# EAGLE design GiGaMega_sield_2 (EAGLE 8.0.0)
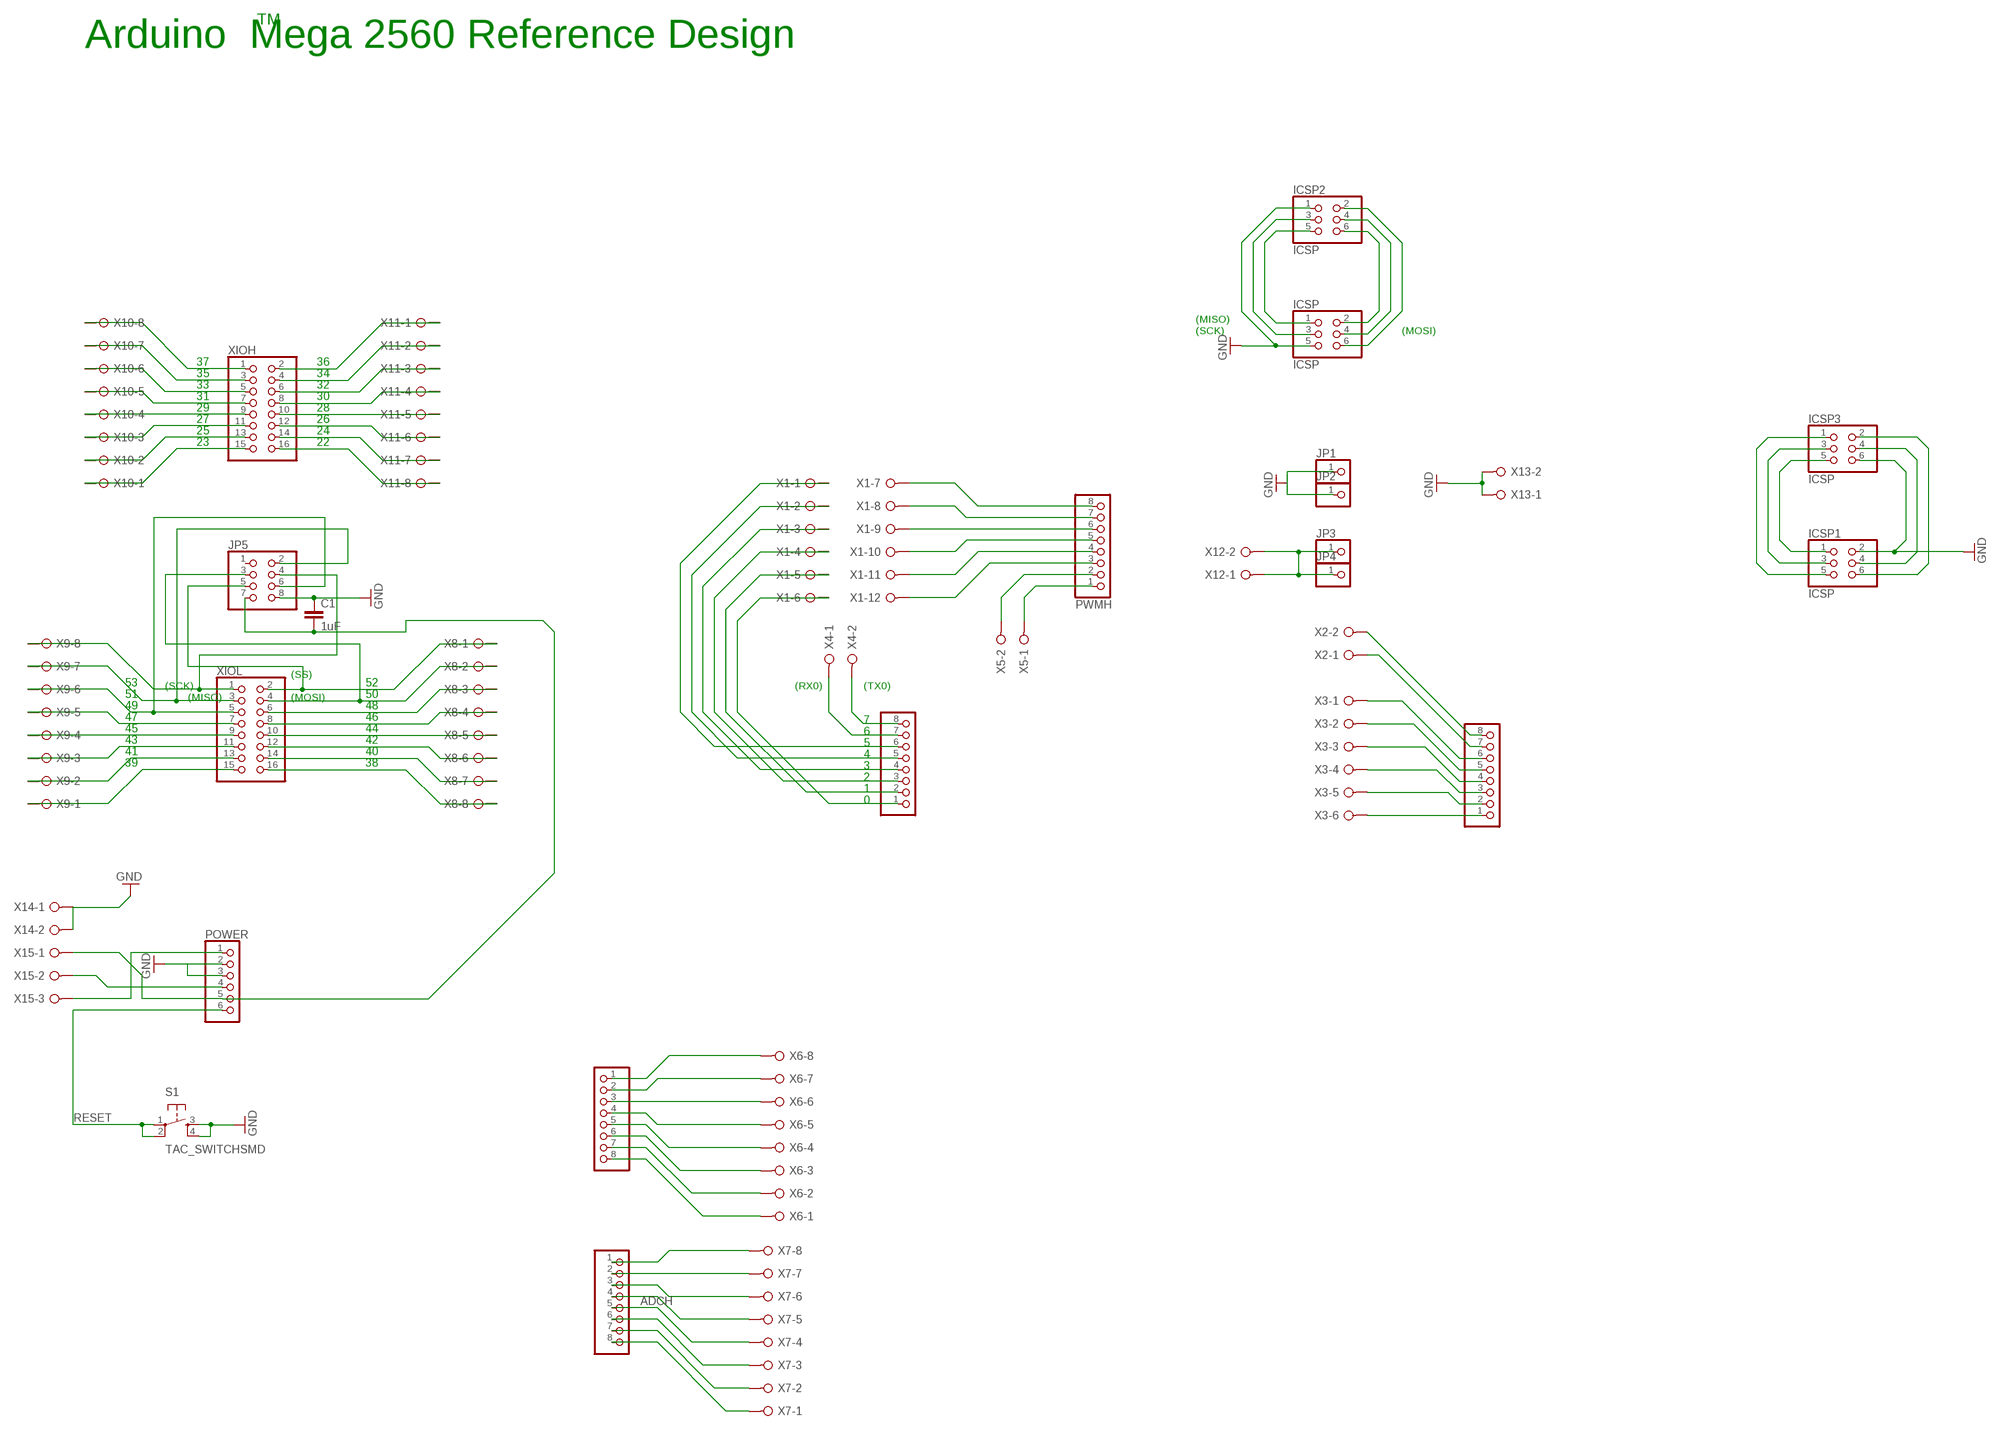
[diagram p0: schematic, sheet 1]

## Parts
ADCH  PINHD-1X8  [1X08]
ADCL  PINHD-1X8  [1X08]
C1  1uF  2.2UF-CERCAP-10009  [1206]
COMMUNICATION  PINHD-1X8  [1X08]
ICSP  ICSP  PINHD-2X3  [2X03]
ICSP1  ICSP  PINHD-2X3  [2X03]
ICSP2  ICSP  PINHD-2X3  [2X03]
ICSP3  ICSP  PINHD-2X3  [2X03]
JP1  PINHD-1X1  [1X01]
JP2  PINHD-1X1  [1X01]
JP3  PINHD-1X1  [1X01]
JP4  PINHD-1X1  [1X01]
JP5  PINHD-2X4  [2X04]
POWER  PINHD-1X6  [1X06]
PWMH  PINHD-1X8  [1X08]
PWML  PINHD-1X8  [1X08]
S1  TAC_SWITCHSMD  [TACTILE-SWITCH-SMD]
X1  W237-12P  [W237-12P]
X2  W237-02P  [W237-132]
X3  W237-06P  [W237-6P]
X4  W237-02P  [W237-132]
X5  W237-02P  [W237-132]
X6  W237-08P  [W237-8P]
X7  W237-08P  [W237-8P]
X8  W237-08P  [W237-8P]
X9  W237-08P  [W237-8P]
X10  W237-08P  [W237-8P]
X11  W237-08P  [W237-8P]
X12  W237-02P  [W237-132]
X13  W237-02P  [W237-132]
X14  W237-02P  [W237-132]
X15  W237-03P  [W237-133]
XIOH  PINHD-2X8  [2X08]
XIOL  PINHD-2X8  [2X08]

## Nets
CE: JP5.6 X9.6 XIOL.5
CSN: JP5.5 X8.1 XIOL.2
GND: C1.1 ICSP1.2 ICSP2.1 ICSP3.6 ICSP.5 JP1.1 JP2.1 JP5.8 POWER.2 POWER.3 S1.3 S1.4 X13.1 X13.2 X14.1 X14.2
MISO: JP5.2 X9.7 XIOL.3
MOSI: JP5.3 X8.2 XIOL.4
N: X8.3 XIOL.6
N$1: ICSP1.1 ICSP3.5
N$2: ICSP1.3 ICSP3.3
N$3: PWMH.8 X1.7
N$4: PWMH.7 X1.8
N$5: PWMH.6 X1.9
N$6: PWMH.5 X1.10
N$7: PWMH.4 X1.11
N$8: PWMH.3 X1.12
N$9: PWML.1 X1.6
N$10: PWML.2 X1.5
N$11: PWML.3 X1.4
N$12: PWML.4 X1.3
N$13: PWML.5 X1.2
N$14: PWML.6 X1.1
N$15: ICSP2.5 ICSP.1
N$16: ICSP2.3 ICSP.3
N$17: ICSP1.5 ICSP3.1
N$18: ICSP2.6 ICSP.2
N$19: ICSP2.4 ICSP.4
N$20: ICSP1.6 ICSP3.2
N$21: ICSP2.2 ICSP.6
N$23: ICSP1.4 ICSP3.4
N$25: COMMUNICATION.1 X3.6
N$26: COMMUNICATION.2 X3.5
N$27: COMMUNICATION.3 X3.4
N$28: COMMUNICATION.4 X3.3
N$29: COMMUNICATION.5 X3.2
N$30: COMMUNICATION.6 X3.1
N$31: COMMUNICATION.7 X2.1
N$32: COMMUNICATION.8 X2.2
N$33: PWML.8 X4.2
N$34: PWML.7 X4.1
N$35: PWMH.2 X5.2
N$36: PWMH.1 X5.1
N$37: ADCL.1 X6.8
N$38: ADCH.1 X7.8
N$39: ADCH.2 X7.7
N$40: ADCL.2 X6.7
N$41: ADCL.3 X6.6
N$42: ADCL.4 X6.5
N$43: ADCL.5 X6.4
N$44: ADCL.6 X6.3
N$45: ADCL.7 X6.2
N$46: ADCL.8 X6.1
N$47: ADCH.3 X7.6
N$48: ADCH.4 X7.5
N$49: ADCH.5 X7.4
N$50: ADCH.6 X7.3
N$51: ADCH.7 X7.2
N$52: ADCH.8 X7.1
N$53: X10.8 XIOH.1
N$54: X11.1 XIOH.2
N$57: X10.7 XIOH.3
N$58: X10.6 XIOH.5
N$59: X10.5 XIOH.7
N$60: X10.4 XIOH.9
N$61: X10.3 XIOH.11
N$62: X10.2 XIOH.13
N$63: X10.1 XIOH.15
N$64: X11.2 XIOH.4
N$65: X11.3 XIOH.6
N$66: X11.4 XIOH.8
N$67: X11.5 XIOH.10
N$68: X11.6 XIOH.12
N$69: X11.7 XIOH.14
N$70: X11.8 XIOH.16
N$73: X9.5 XIOL.7
N$74: X9.4 XIOL.9
N$75: X9.3 XIOL.11
N$76: X9.2 XIOL.13
N$77: X9.1 XIOL.15
N$80: X8.4 XIOL.8
N$81: X8.5 XIOL.10
N$82: X8.6 XIOL.12
N$83: X8.7 XIOL.14
N$84: X8.8 XIOL.16
N$85: POWER.1 X15.3
N$86: POWER.4 X15.2
N$90: C1.2 JP5.7 POWER.5 X15.1
N$92: JP3.1 JP4.1 X12.1 X12.2
RESET: POWER.6 S1.1 S1.2
SCK: JP5.4 X9.8 XIOL.1
Unconnected: JP5.1

## Notes on the sheet
- TM
- Arduino  Mega 2560 Reference Design
- (MISO)
- (SCK) | (MOSI)
- 37 | 36
- 35 | 34
- 33 | 32
- 31 | 30
- 29 | 28
- 27 | 26
- 25 | 24
- 23 | 22
- (SS)
- 53 | (SCK) | 52 | (RX0) | (TX0)
- 51 | (MISO) | (MOSI) | 50
- 49 | 48
- 47 | 46 | 7
- 45 | 44 | 6
- 43 | 42 | 5
- 41 | 40 | 4
- 39 | 38 | 3
- 2
- 1
- 0

## Library data of the parts
ADCH ADCL COMMUNICATION PWMH PWML = pinhead:PINHD-1X8: PIN HEADER
C1 = SparkFun-Retired:2.2UF-CER: 2.2uF Ceramic SMT CAP-07888- 10V, 20% (0603) CAP-10009- 50V, 10% (1206); PROD_ID: CAP-10009; VALUE: 2.2uF
ICSP ICSP1-ICSP3 = pinhead:PINHD-2X3: PIN HEADER
JP1-JP4 = pinhead:PINHD-1X1: PIN HEADER
JP5 = pinhead:PINHD-2X4: PIN HEADER
POWER = pinhead:PINHD-1X6: PIN HEADER
S1 = SparkFun-Retired:TAC_SWITCH: Momentary Switch Button commonly used for reset or general input. Spark Fun Electronics SKU : COM-00097 SMT- SWCH-08247; PROD_ID: SWCH-08247
X1 = con-wago-508:W237-12P: WAGO SREW CLAMP; OC_FARNELL: unknown; OC_NEWARK: unknown
X2 X4 X5 X12-X14 = con-wago-508:W237-02P: WAGO SREW CLAMP; OC_FARNELL: unknown; OC_NEWARK: unknown
X3 = con-wago-508:W237-06P: WAGO SREW CLAMP; OC_FARNELL: unknown; OC_NEWARK: unknown
X6-X11 = con-wago-508:W237-08P: WAGO SREW CLAMP; OC_FARNELL: unknown; OC_NEWARK: unknown
X15 = con-wago-508:W237-03P: WAGO SREW CLAMP; OC_FARNELL: unknown; OC_NEWARK: unknown
XIOH XIOL = pinhead:PINHD-2X8: PIN HEADER

## Net classes
0 default: width 0.15 mm, drill 0.3 mm, clearance 0.15 mm

## Board
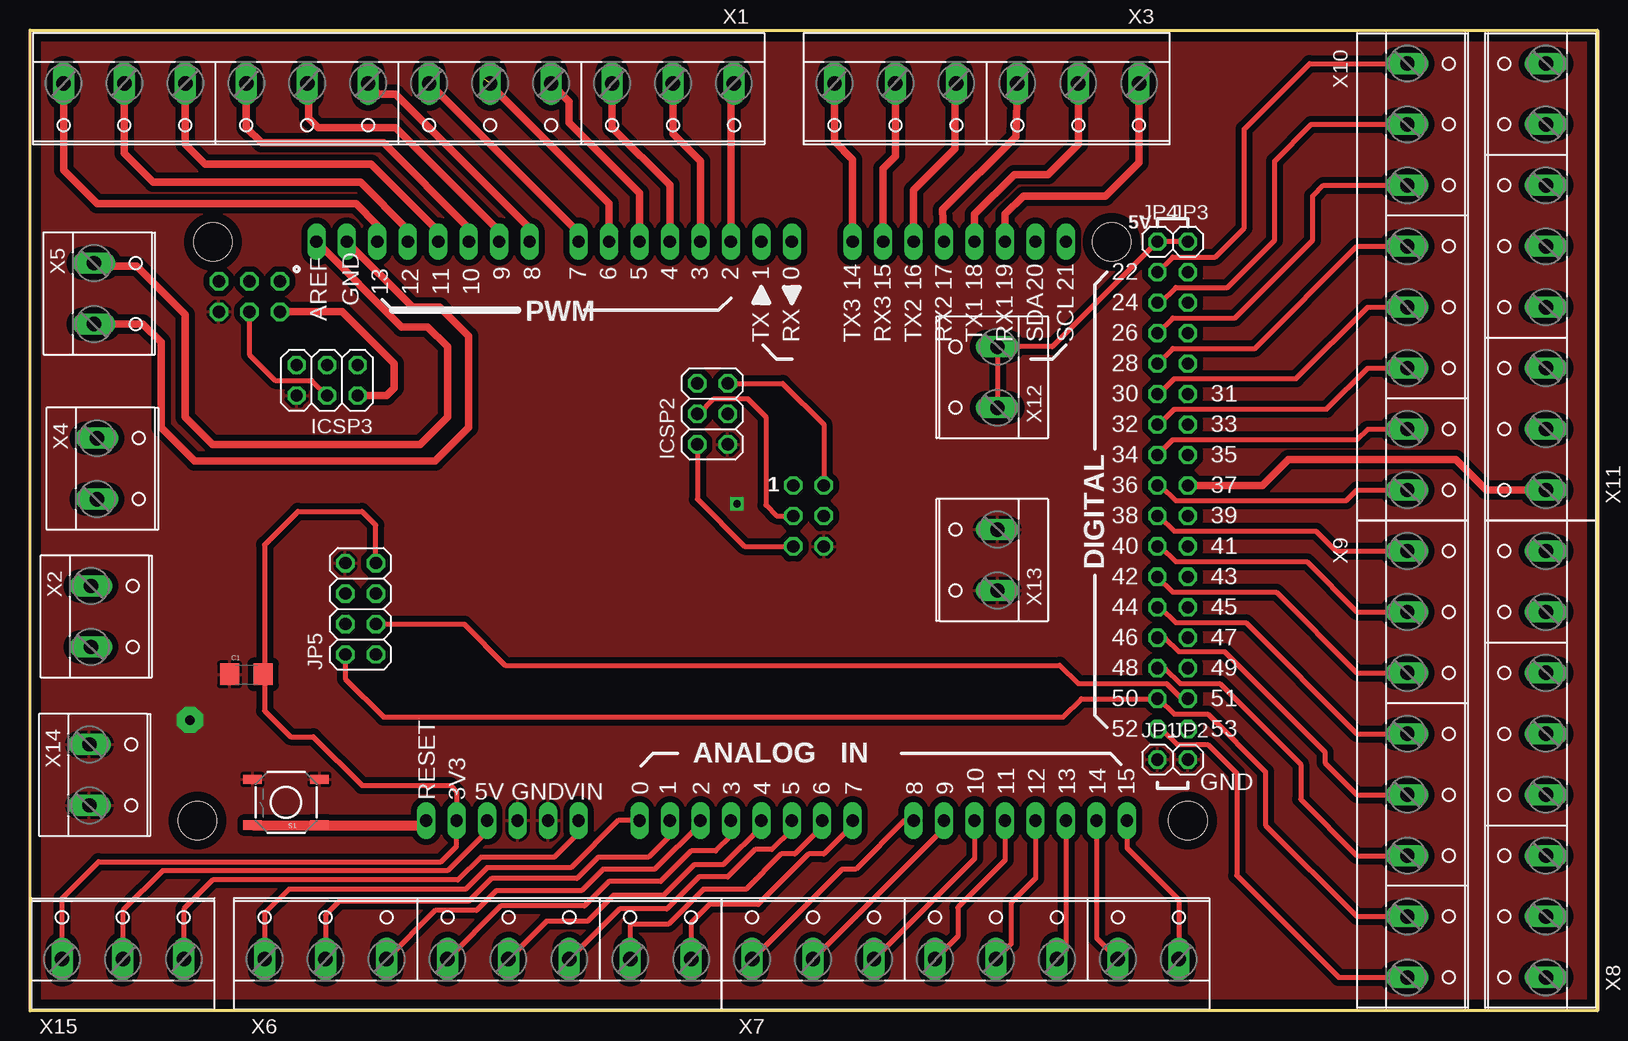
[diagram p1: board, top side]
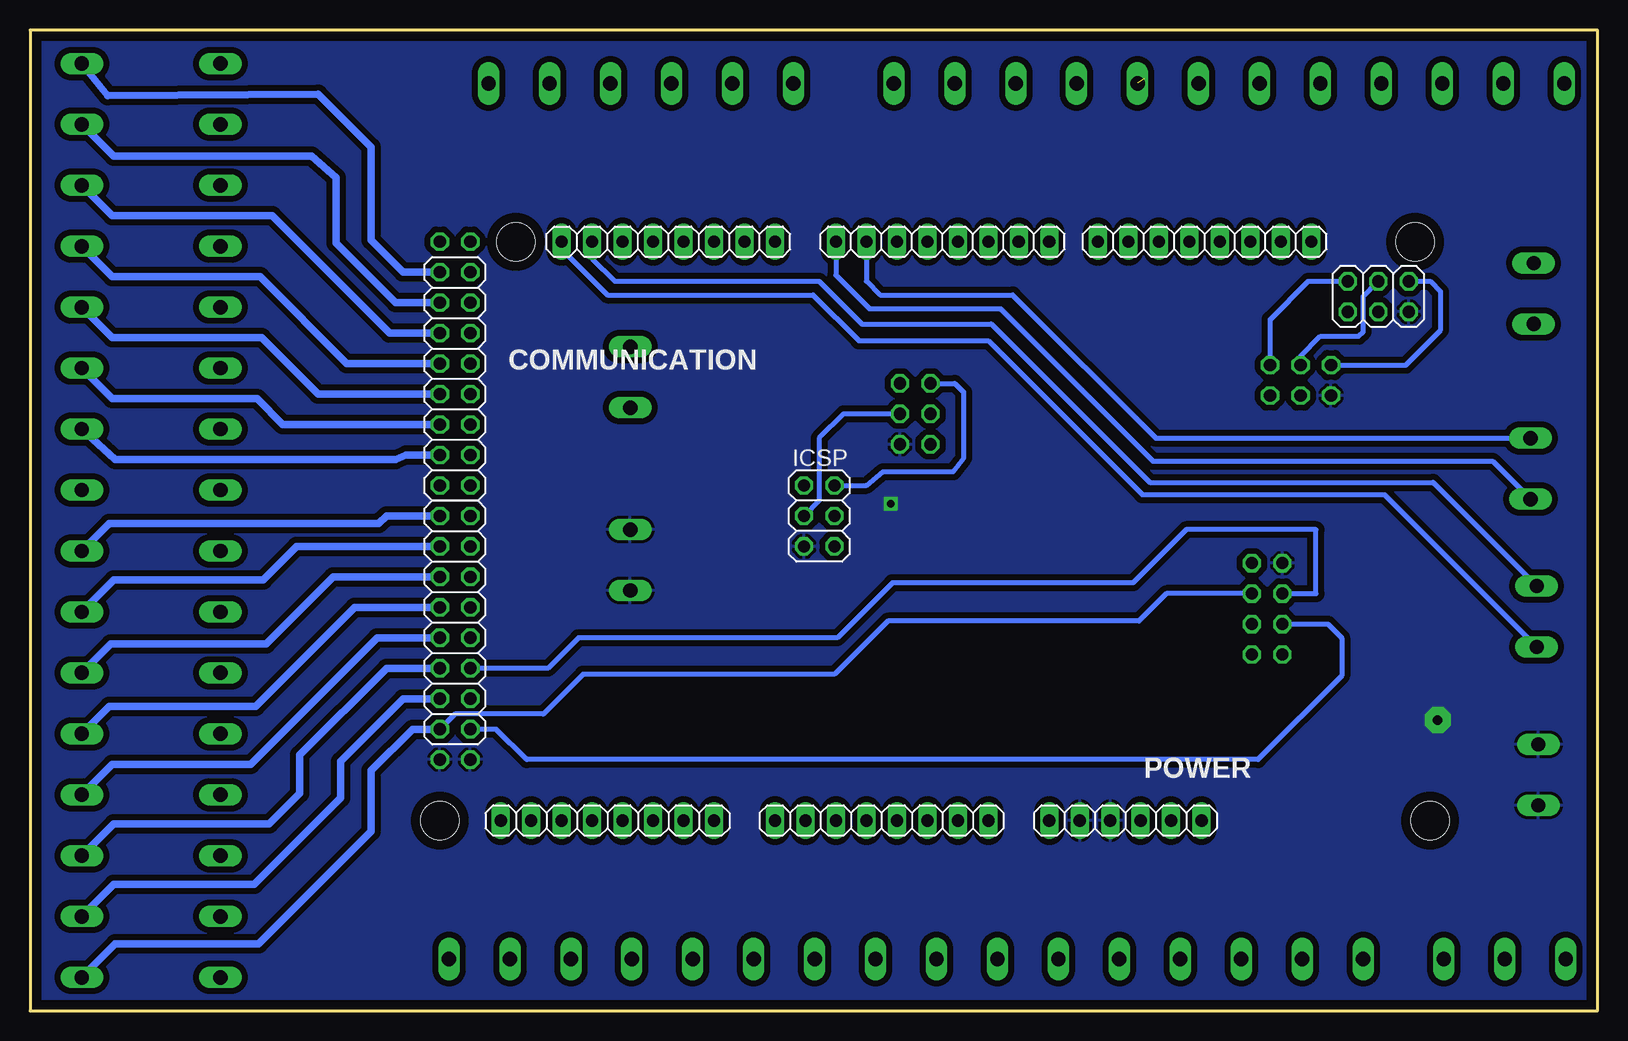
[diagram p2: board, bottom side, seen from below]

Size 130.68 x 81.79 mm. Coordinates in mm from the lower left corner, seen from the top.
Outline: 0,81.79 130.68,81.79 130.68,0 0,0 0,81.79
Copper layers (1*16): Top 0.035mm / dielectric 1.5mm / Bottom 0.035mm
Design rules "default *": minimum track width 0.3mm, minimum drill 0.5mm, track to track 0.5mm, track to pad 0.5mm, pad to pad 0.5mm, via to via 0.5mm, smd to smd 0.5mm, copper to edge 0.8mm, drill to drill 0.5mm, minimum pad ring 10mil, minimum via ring 10mil, stop-mask expansion 2mil, vias tented up to drill 1mil, thermal gap 10mil
Holes 3.2 mm at 96.52,15.88 15.24,64.13 90.17,64.13 13.97,15.88

### Footprints (pad centres in the part's own frame; a part is rotated, then mirrored left to right if it is on the bottom)
1X08 = drill 1.016 long: 1 -8.89,0; 2 -6.35,0; 3 -3.81,0; 4 -1.27,0; 5 1.27,0; 6 3.81,0; 7 6.35,0; 8 8.89,0
1206 = smd 1.6 x 1.8: 1 -1.4,0; 2 1.4,0
2X03 = drill 1.016 octagon: 1 -2.54,-1.27; 2 -2.54,1.27; 3 0,-1.27; 4 0,1.27; 5 2.54,-1.27; 6 2.54,1.27
1X01 = drill 1.016 octagon: 1 0,0
2X04 = drill 1.016 octagon: 1 -3.81,-1.27; 2 -3.81,1.27; 3 -1.27,-1.27; 4 -1.27,1.27; 5 1.27,-1.27; 6 1.27,1.27; 7 3.81,-1.27; 8 3.81,1.27
1X06 = drill 1.016 long: 1 -6.35,0; 2 -3.81,0; 3 -1.27,0; 4 1.27,0; 5 3.81,0; 6 6.35,0
TACTILE-SWITCH-SMD = smd 1.524 x 0.762: 1 -2.794,1.905; 2 2.794,1.905; 3 -2.794,-1.905; 4 2.794,-1.905
W237-12P = drill 1.194 long: 1 -27.94,-0.635; 2 -22.86,-0.635; 3 -17.78,-0.635; 4 -12.7,-0.635; 5 -7.62,-0.635; 6 -2.54,-0.635; 7 2.54,-0.635; 8 7.62,-0.635; 9 12.7,-0.635; 10 17.78,-0.635; 11 22.86,-0.635; 12 27.94,-0.635
W237-132 = drill 1.194 long: 1 -2.54,-0.635; 2 2.54,-0.635
W237-6P = drill 1.194 long: 1 -12.7,-0.635; 2 -7.62,-0.635; 3 -2.54,-0.635; 4 2.54,-0.635; 5 7.62,-0.635; 6 12.7,-0.635
W237-8P = drill 1.194 long: 1 -17.78,-0.635; 2 -12.7,-0.635; 3 -7.62,-0.635; 4 -2.54,-0.635; 5 2.54,-0.635; 6 7.62,-0.635; 7 12.7,-0.635; 8 17.78,-0.635
W237-133 = drill 1.194 long: 1 -5.08,-0.635; 2 0,-0.635; 3 5.08,-0.635
2X08 = drill 1.016 octagon: 1 -8.89,-1.27; 2 -8.89,1.27; 3 -6.35,-1.27; 4 -6.35,1.27; 5 -3.81,-1.27; 6 -3.81,1.27; 7 -1.27,-1.27; 8 -1.27,1.27; 9 1.27,-1.27; 10 1.27,1.27; 11 3.81,-1.27; 12 3.81,1.27; 13 6.35,-1.27; 14 6.35,1.27; 15 8.89,-1.27; 16 8.89,1.27

### Placement (x,y rotation side)
ADCH  82.55,15.88 0 bottom
ADCL  59.69,15.88 0 bottom
C1  18.03,28.07 0 top
COMMUNICATION  77.47,64.13 180 bottom
ICSP  64.9,41.28 270 bottom
ICSP1  18.29,59.56 180 bottom
ICSP2  56.9,49.78 90 top
ICSP3  24.77,52.58 180 top
JP1  93.98,20.96 0 top
JP2  96.52,20.96 0 top
JP3  96.52,64.13 0 top
JP4  93.98,64.13 0 top
JP5  27.56,33.53 90 top
POWER  39.37,15.88 0 bottom
PWMH  32.77,64.13 180 bottom
PWML  54.61,64.13 180 bottom
S1  21.34,17.4 180 top
X1  30.73,76.71 180 top
X2  5.71,32.89 270 top
X3  79.76,76.71 180 top
X4  6.22,45.21 270 top
X5  5.97,59.82 270 top
X6  37.34,4.95 0 top
X7  77.98,4.95 0 top
X8  125.73,20.57 90 top
X9  115.44,20.57 270 top
X10  115.44,61.21 270 top
X11  125.73,61.21 90 top
X12  80.01,52.83 90 top
X13  80.01,37.59 90 top
X14  5.59,19.69 270 top
X15  7.75,4.95 0 top
XIOH  95.25,52.7 90 bottom
XIOL  95.25,32.39 90 bottom

### Tracks (layer width: path | path; a pad name or v marks a point on that pad's centre or on a via)
CE
  Top 0.406: XIOL.5 94.61,28.58 95.89,27.3 99.19,27.3 105.92,20.57 105.92,17.65 110.62,12.95 X9.6
  Bottom 0.406: JP5.6 23.5,34.8 23.5,40.13 34.29,40.13 38.73,35.69 58.8,35.69 63.37,31.12 84.96,31.12 87.5,28.58 XIOL.5
CSN
  Bottom 0.406: JP5.5 35.94,34.8 38.23,32.51 59.18,32.51 63.63,28.07 84.58,28.07 87.88,24.77 95.25,24.77 XIOL.2
  Bottom 0.61: XIOL.2 98.81,23.5 102.23,20.07 102.23,14.99 111.63,5.59 123.57,5.59 X8.1
GND  (via drill 0.6, 0.8 pad 2.18)
  other vias: 13.34,24.26 58.93,42.29
  pour Top (isolate 0.305, rank 2): 0,81.79 130.68,81.79 130.68,0 0,0
  pour Bottom (isolate 0.356, rank 2): 0,81.79 130.68,81.79 130.68,0 0,0
MISO
  Top 0.406: X9.7 110.62,7.87 103,15.49 103,19.94 98.17,24.77 95.38,24.77 94.11,26.04 XIOL.3 87.63,26.04 86.11,24.51 29.46,24.51 26.29,27.69 JP5.2
MOSI
  Top 0.406: JP5.3 36.2,32.26 39.62,28.83 85.85,28.83 87.38,27.3 94.74,27.3 95.89,26.16 96.39,26.16 XIOL.4
  Bottom 0.61: XIOL.4 99.57,26.04 104.78,20.83 104.78,17.78 112.01,10.54 123.7,10.54 X8.2
N
  Bottom 0.61: XIOL.6 100.97,28.58 108.2,21.34 108.2,18.16 110.74,15.62 123.7,15.62 X8.3
N$1
  Bottom 0.406: ICSP1.1 13.97,60.83 13.08,59.94 13.08,56.77 16,53.85 ICSP3.5
N$2
  Bottom 0.406: ICSP3.3 24.77,54.61 23.11,56.26 19.94,56.26 19.56,56.64 19.56,59.56 ICSP1.3
N$3
  Top 0.61: PWMH.8 41.66,65.28 30.48,76.45 29.08,76.45 X1.7
N$4
  Top 0.61: PWMH.7 39.12,65.02 30.48,73.66 24,73.66 23.24,74.42 23.24,77.22 X1.8
N$5
  Top 0.61: PWMH.6 36.58,65.28 29.46,72.39 19.3,72.39 18.03,73.66 X1.9
N$6
  Top 0.61: PWMH.5 34.04,65.02 28.45,70.61 14.61,70.61 12.95,72.26 X1.10
N$7
  Top 0.61: PWMH.4 31.5,65.15 27.56,69.09 10.29,69.09 7.87,71.5 X1.11
N$8
  Top 0.61: PWMH.3 28.96,65.53 27.18,67.31 5.59,67.31 2.79,70.1 X1.12
N$9
  Top 0.61: PWML.1 45.72,64.9 X1.6
N$10  (1 unrouted)
  Top 0.61: PWML.2 48.26,67.31 37.85,77.72
N$11
  Top 0.61: PWML.3 50.8,68.2 44.96,74.04 44.96,75.82 X1.4
N$12
  Top 0.61: PWML.4 53.34,68.83 48.51,73.66 X1.3
N$13
  Top 0.61: PWML.5 55.88,70.87 53.59,73.15 X1.2
N$14
  Top 0.61: PWML.6 58.42,77.09 X1.1
N$15
  Top 0.406: ICSP2.5 62.74,52.32 66.17,48.9 ICSP.1
N$16
  Bottom 0.406: ICSP2.3 62.87,49.78 64.9,47.75 64.9,42.55 ICSP.3
N$17
  Bottom 0.406: ICSP3.1 27.3,57.66 24.13,60.83 ICSP1.5
N$18
  Bottom 0.406: ICSP2.6 53.59,52.32 52.83,51.56 52.83,46.1 53.72,44.96 59.56,44.96 60.96,43.81 ICSP.2
N$19
  Top 0.406: ICSP2.4 55.75,49.78 57.02,51.05 59.82,51.05 61.34,49.53 61.34,42.16 62.23,41.28 ICSP.4
N$20
  Top 0.61: ICSP3.2 29.72,51.31 30.35,51.94 30.35,53.98 26.04,58.29 ICSP1.6
N$21
  Top 0.406: ICSP2.2 55.63,42.67 59.56,38.73 ICSP.6
N$23
  Top 0.406: ICSP1.4 18.29,54.74 20.45,52.58 23.5,52.58 ICSP3.4
N$25
  Top 0.61: COMMUNICATION.1 68.58,70.99 67.06,72.52 X3.6
N$26
  Top 0.61: COMMUNICATION.2 71.12,70.23 72.14,71.25 X3.5
N$27
  Top 0.61: COMMUNICATION.3 73.66,68.45 77.09,71.88 77.09,77.22 X3.4
N$28
  Top 0.61: COMMUNICATION.4 76.07,66.8 82.17,72.9 X3.3
N$29
  Top 0.61: COMMUNICATION.5 78.74,66.42 82.04,69.72 84.84,69.72 87.38,72.26 X3.2
N$30
  Top 0.61: COMMUNICATION.6 81.28,66.42 82.8,67.94 89.66,67.94 92.46,70.74 X3.1
N$31
  Bottom 0.406: COMMUNICATION.7 83.82,62.74 81.92,60.83 64.9,60.83 61.34,57.28 50.55,57.28 37.34,44.07 13.72,44.07 X2.1
N$32
  Bottom 0.406: COMMUNICATION.8 86.36,63.5 82.55,59.69 65.41,59.69 61.59,55.88 50.8,55.88 37.97,43.05 17.78,43.05 X2.2
N$33
  Bottom 0.406: PWML.8 63.5,61.34 60.71,58.55 49.78,58.55 37.08,45.85 8.76,45.85 X4.2
N$34
  Bottom 0.406: PWML.7 60.96,60.83 59.82,59.69 48.77,59.69 36.83,47.75 X4.1
N$35
  Top 0.61: X5.2 9.4,57.28 10.92,55.75 10.92,48.64 13.72,45.85 31.11,45.85 33.78,45.85 36.58,48.64 36.58,56.26 34.16,58.67 31.88,58.67 PWMH.2
N$36
  Top 0.61: X5.1 5.59,62.1 8.89,62.1 12.95,58.04 12.95,49.53 15.24,47.24 32.51,47.24 34.8,49.53 34.8,55.37 33.15,57.02 30.99,57.02 PWMH.1
N$37
  Top 0.406: ADCL.1 68.58,15.49 66.17,13.08 64.9,13.08 60.71,8.89 56.64,8.89 55.12,7.37 X6.8
N$38
  Top 0.406: ADCH.1 91.44,13.59 95.76,9.27 X7.8
N$39
  Top 0.406: ADCH.2 88.9,6.1 X7.7
N$40
  Top 0.305: 50.16,7.24 50.04,7.11
  Top 0.406: ADCL.2 66.04,15.37 63.75,13.08 62.61,13.08 59.69,10.16 56.13,10.16 53.21,7.24 50.16,7.24 | 50.04,7.11 X6.7
N$41
  Top 0.406: ADCL.3 63.5,15.11 61.85,13.46 60.45,13.46 58.17,11.18 55.75,11.18 53.09,8.51 49.15,8.51 X6.6
N$42
  Top 0.406: ADCL.4 60.96,15.37 57.78,12.19 55.37,12.19 52.83,9.65 48.64,9.65 46.48,7.49 43.05,7.49 X6.5
N$43
  Top 0.406: ADCL.5 58.42,14.61 57.15,13.34 55.12,13.34 52.58,10.8 48.26,10.8 46.23,8.76 39.24,8.76 X6.4
N$44
  Top 0.305: ADCL.6 55.88,15.62
  Top 0.406: 55.88,15.62 52.07,11.81 47.75,11.81 45.97,10.03 38.86,10.03 37.21,8.38 33.78,8.38 X6.3
N$45
  Top 0.406: ADCL.7 53.34,14.61 51.56,12.83 47.37,12.83 45.59,11.05 38.48,11.05 36.58,9.14 25.78,9.14 24.64,8 X6.2
N$46
  Top 0.406: ADCL.8 49.02,15.88 45.09,11.94 38.1,11.94 36.32,10.16 21.59,10.16 19.56,8.13 X6.1
N$47
  Top 0.406: ADCH.3 86.36,5.08 X7.6
N$48
  Top 0.406: ADCH.4 83.82,11.05 81.79,9.02 81.79,5.59 X7.5
N$49
  Top 0.406: ADCH.5 81.28,12.57 77.34,8.64 77.34,6.22 X7.4
N$50
  Top 0.406: ADCH.6 78.74,12.7 X7.3
N$51
  Top 0.305: ADCH.7 76.2,15.24
  Top 0.406: 76.2,15.24 X7.2
N$52
  Top 0.406: ADCH.8 72.9,15.88 68.83,11.81 67.69,11.81 X7.1
N$53
  Top 0.406: XIOH.1 94.23,43.81 95.5,42.55 109.73,42.55 110.62,43.43 X10.8
N$54
  Top 0.61: XIOH.2 102.74,43.81 104.9,45.97 118.87,45.97 121.41,43.43 X11.1
N$57
  Top 0.406: XIOH.3 95.25,47.62 110.62,47.62 111.51,48.51 X10.7
N$58
  Top 0.406: XIOH.5 94.11,48.9 95.38,50.16 108.08,50.16 111.51,53.59 X10.6
N$59
  Top 0.406: XIOH.7 94.11,51.44 95.38,52.7 105.54,52.7 111.51,58.67 X10.5
N$60
  Top 0.406: XIOH.9 95.25,55.24 102.11,55.24 110.62,63.75 X10.4
N$61
  Top 0.406: XIOH.11 95.25,57.79 100.46,57.79 106.93,64.26 106.93,67.94 107.82,68.83 X10.3
N$62
  Top 0.406: XIOH.13 94.23,59.05 95.5,60.33 99.82,60.33 103.76,64.26 103.76,70.87 106.81,73.91 X10.2
N$63
  Top 0.406: XIOH.15 95.25,62.87 98.81,62.87 101.22,65.28 101.22,73.53 106.68,78.99 X10.1
N$64
  Bottom 0.61: XIOH.4 99.31,46.36 100.2,45.97 123.57,45.97 X11.2
N$65
  Bottom 0.61: XIOH.6 109.6,48.9 111.76,51.05 123.83,51.05 X11.3
N$66
  Bottom 0.61: XIOH.8 106.68,51.44 111.38,56.13 123.83,56.13 X11.4
N$67
  Bottom 0.61: XIOH.10 104.27,53.98 111.51,61.21 123.83,61.21 X11.5
N$68
  Bottom 0.61: XIOH.12 100.71,56.52 110.49,66.29 123.83,66.29 X11.6
N$69
  Bottom 0.61: XIOH.14 100.2,59.05 105.16,64.01 105.16,69.47 107.19,71.25 123.7,71.25 X11.7
N$70
  Bottom 0.61: XIOH.16 99.57,61.59 102.23,64.26 102.23,72.01 106.68,76.45 124.21,76.33 X11.8
N$73
  Top 0.406: XIOL.7 94.61,31.12 95.76,29.97 99.57,29.97 107.95,21.59 107.95,20.7 110.62,18.03 X9.5
N$74
  Top 0.406: XIOL.9 94.23,33.66 95.5,32.39 101.35,32.39 110.62,23.11 X9.4
N$75
  Top 0.406: XIOL.11 95.25,34.92 103.89,34.92 110.62,28.19 X9.3
N$76
  Top 0.406: XIOL.13 94.23,38.73 95.5,37.47 106.43,37.47 110.62,33.27 X9.2
N$77
  Top 0.406: XIOL.15 94.11,41.28 95.38,40.01 107.19,40.01 108.84,38.35 X9.1
N$80
  Bottom 0.61: XIOL.8 101.73,31.12 112.27,20.57 123.83,20.57 X8.4
N$81
  Bottom 0.61: XIOL.10 103.63,33.66 111.89,25.4 124.08,25.4 X8.5
N$82
  Bottom 0.61: XIOL.12 105.41,36.2 111,30.61 123.95,30.61 X8.6
N$83
  Bottom 0.61: XIOL.14 108.46,38.73 111.25,35.94 123.7,35.94 X8.7
N$84
  Bottom 0.61: XIOL.16 100.97,41.28 101.6,40.64 124.08,40.64 X8.8
N$85
  Top 0.406: POWER.1 45.72,14.86 43.69,12.83 37.59,12.83 35.69,10.92 15.24,10.92 12.83,8.51 X15.3
N$86
  Top 0.406: POWER.4 38.1,14.99 34.8,11.68 11.05,11.68 7.75,8.38 X15.2
N$90
  Top 0.305: 19.56,28.19 C1.2
  Top 0.406: JP5.7 28.83,40.51 27.69,41.66 22.35,41.66 19.56,38.86 19.56,28.19 19.56,25.02 21.72,22.86 23.62,22.86 27.69,18.8 35.05,18.8 35.56,18.29 POWER.5 35.56,13.72 34.29,12.45 5.71,12.45 2.67,9.4 X15.1
N$92
  Top 0.406: JP3.1 JP4.1 85.22,55.37 X12.2 X12.1
RESET
  Top 0.813: S1.2 S1.1 33.02,15.49 POWER.6
SCK
  Top 0.406: XIOL.1 94.36,23.5 95.63,22.23 98.17,22.23 100.58,19.81 100.58,11.3 109.09,2.79 X9.8
  Bottom 0.406: JP5.4 22.48,32.26 21.34,31.12 21.34,27.94 28.32,20.96 89.28,20.96 91.82,23.5 XIOL.1

### Text on the board
tPlace: 9 | 8 | 7 | 6 | 5 | 4 | 3 | 2 | 1 | 0 | 22 | 14 | 15 | 16 | 17 | 18 | 19 | 20 | 21 | 13 | 12 | 11 | 10 | 24 | 26 | 28 | 30 | 31 | 32 | 33 | 34 | 35 | 36 | 37 | 38 | 39 | 40 | 41 | 42 | 43 | 44 | 45 | 46 | 47 | 48 | 49 | 50 | 51 | 52 | 53 | 0 | 1 | 2 | 3 | 4 | 5 | 6 | 7 | 8 | 9 | 10 | 11 | 12 | 13 | 14 | 15
tNames: 5V | GND | AREF | PWM | TX | RX | TX3 | RX3 | TX2 | RX2 | TX1 | RX1 | SDA | SCL | 1 | DIGITAL | ANALOG IN | GND | RESET | 3V3 | 5V | GND | VIN